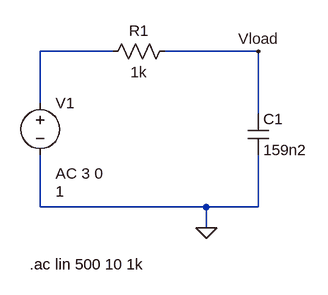
[diagram p0: schematic Experiment 7A.asc]
Experiment 7A.asc, the LTspice schematic file:
Version 4
SHEET 1 880 680
WIRE 208 32 96 32
WIRE 432 32 288 32
WIRE 96 112 96 32
WIRE 432 128 432 32
WIRE 96 272 96 192
WIRE 352 272 96 272
WIRE 432 272 432 192
WIRE 432 272 352 272
WIRE 352 304 352 272
FLAG 352 304 0
FLAG 432 32 Vload
SYMBOL voltage 96 96 R0
WINDOW 3 24 152 Left 2
WINDOW 123 24 124 Left 2
WINDOW 39 0 0 Left 0
SYMATTR InstName V1
SYMATTR Value 1
SYMATTR Value2 AC 3 0
SYMBOL res 304 16 R90
WINDOW 0 0 56 VBottom 2
WINDOW 3 32 56 VTop 2
SYMATTR InstName R1
SYMATTR Value 1k
SYMBOL cap 416 128 R0
SYMATTR InstName C1
SYMATTR Value 159n2
TEXT 80 360 Left 2 !.ac lin 500 10 1k

The netlist it stands for:
* Experiment 7A.asc
V1 N001 0 1 AC 3 0
R1 Vload N001 1k
C1 Vload 0 159n2
.ac lin 500 10 1k
.backanno
.end

* Results of the author's LTspice run, read from the files saved beside the schematic
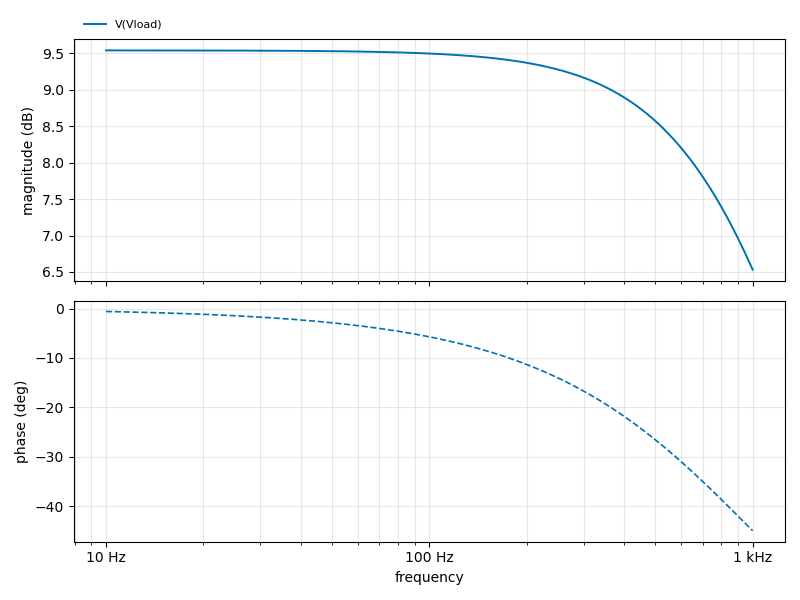
[diagram p1: AC Analysis of Experiment 7A.asc, plotted from the saved traces]
* AC Analysis, 1 run:
*   V(Vload): 9.54 dB at 10 Hz, 6.53 dB at 1 kHz, peak 9.54 dB at 10 Hz, 3 dB below the peak at 999.8 Hz